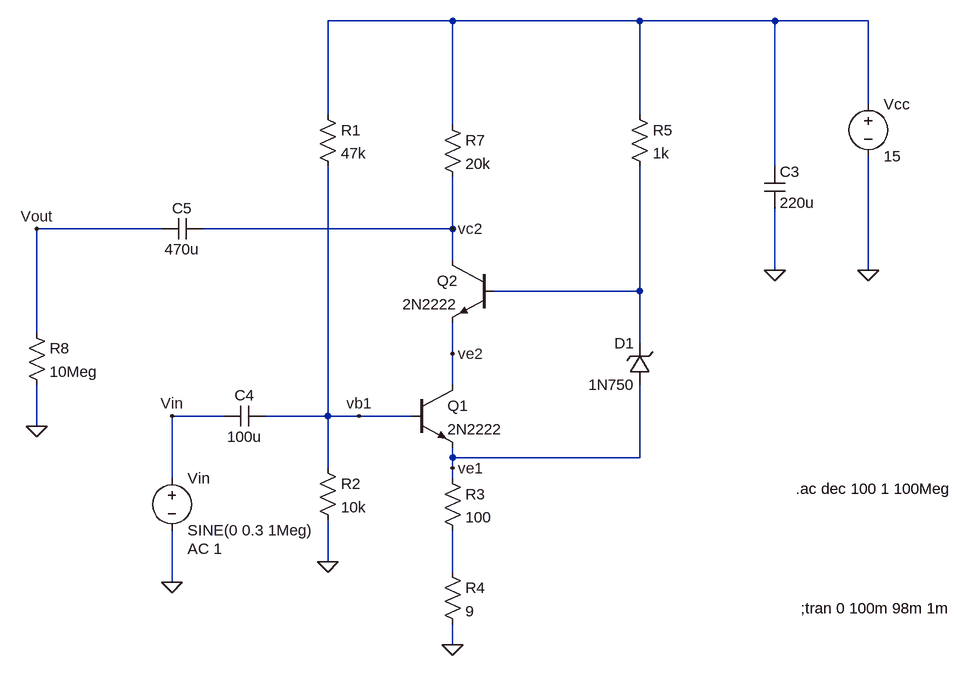
[diagram p0: schematic Cascode.asc]
Cascode.asc, the LTspice schematic file:
Version 4
SHEET 1 880 680
WIRE -112 -336 -304 -336
WIRE 176 -336 -112 -336
WIRE 384 -336 176 -336
WIRE 528 -336 384 -336
WIRE 528 -208 528 -336
WIRE -304 -192 -304 -336
WIRE 176 -192 176 -336
WIRE -112 -176 -112 -336
WIRE 384 -112 384 -336
WIRE -560 -16 -752 -16
WIRE -112 -16 -112 -96
WIRE -112 -16 -496 -16
WIRE -112 32 -112 -16
WIRE 384 48 384 -48
WIRE 528 48 528 -128
WIRE 176 80 176 -112
WIRE 176 80 -48 80
WIRE -752 144 -752 -16
WIRE 176 160 176 80
WIRE -112 176 -112 128
WIRE -112 224 -112 176
WIRE -464 272 -544 272
WIRE -304 272 -304 -112
WIRE -304 272 -400 272
WIRE -256 272 -304 272
WIRE -176 272 -256 272
WIRE -752 288 -752 224
WIRE -112 336 -112 320
WIRE 176 336 176 224
WIRE 176 336 -112 336
WIRE -304 352 -304 272
WIRE -112 352 -112 336
WIRE -544 368 -544 272
WIRE -112 368 -112 352
WIRE -304 496 -304 432
WIRE -112 512 -112 448
WIRE -544 528 -544 448
WIRE -112 624 -112 592
FLAG -304 496 0
FLAG -112 624 0
FLAG -544 528 0
FLAG 384 48 0
FLAG 528 48 0
FLAG -544 272 Vin
FLAG -752 288 0
FLAG -752 -16 Vout
FLAG -112 -16 vc2
FLAG -112 352 ve1
FLAG -112 176 ve2
FLAG -256 272 vb1
SYMBOL npn -176 224 R0
SYMATTR InstName Q1
SYMATTR Value 2N2222
SYMBOL npn -48 32 M0
SYMATTR InstName Q2
SYMATTR Value 2N2222
SYMBOL res -320 -208 R0
SYMATTR InstName R1
SYMATTR Value 47k
SYMBOL res -320 336 R0
SYMATTR InstName R2
SYMATTR Value 10k
SYMBOL res -128 352 R0
SYMATTR InstName R3
SYMATTR Value 100
SYMBOL res -128 496 R0
SYMATTR InstName R4
SYMATTR Value 9
SYMBOL res 160 -208 R0
SYMATTR InstName R5
SYMATTR Value 1k
SYMBOL res -128 -192 R0
SYMATTR InstName R7
SYMATTR Value 20k
SYMBOL cap 368 -112 R0
SYMATTR InstName C3
SYMATTR Value 220u
SYMBOL cap -400 256 R90
WINDOW 0 0 32 VBottom 2
WINDOW 3 32 32 VTop 2
SYMATTR InstName C4
SYMATTR Value 100u
SYMBOL voltage -544 352 R0
WINDOW 123 24 124 Left 2
WINDOW 39 0 0 Left 2
SYMATTR Value2 AC 1
SYMATTR InstName Vin
SYMATTR Value SINE(0 0.3 1Meg)
SYMBOL voltage 528 -224 R0
WINDOW 123 0 0 Left 2
WINDOW 39 0 0 Left 2
SYMATTR InstName Vcc
SYMATTR Value 15
SYMBOL res -768 128 R0
SYMATTR InstName R8
SYMATTR Value 10Meg
SYMBOL cap -496 -32 R90
WINDOW 0 0 32 VBottom 2
WINDOW 3 32 32 VTop 2
SYMATTR InstName C5
SYMATTR Value 470u
SYMBOL zener 192 224 R180
WINDOW 0 24 64 Left 2
WINDOW 3 24 0 Left 2
SYMATTR InstName D1
SYMATTR Value 1N750
SYMATTR Description Diode
SYMATTR Type diode
TEXT 424 568 Left 2 !;tran 0 100m 98m 1m
TEXT 416 384 Left 2 !.ac dec 100 1 100Meg

The netlist it stands for:
* Cascode.asc
Q1 ve2 vb1 ve1 0 2N2222
Q2 vc2 N002 ve2 0 2N2222
R1 N001 vb1 47k
R2 vb1 0 10k
R3 ve1 N003 100
R4 N003 0 9
R5 N001 N002 1k
R7 N001 vc2 20k
C3 N001 0 220u
C4 vb1 Vin 100u
Vin Vin 0 SINE(0 0.3 1Meg) AC 1
Vcc N001 0 15
R8 Vout 0 10Meg
C5 vc2 Vout 470u
D1 ve1 N002 1N750
.model D D
.lib standard.dio
.model NPN NPN
.model PNP PNP
.lib standard.bjt
;tran 0 100m 98m 1m
.ac dec 100 1 100Meg
.backanno
.end